# EAGLE design USBIOV2 (EAGLE 6.4)
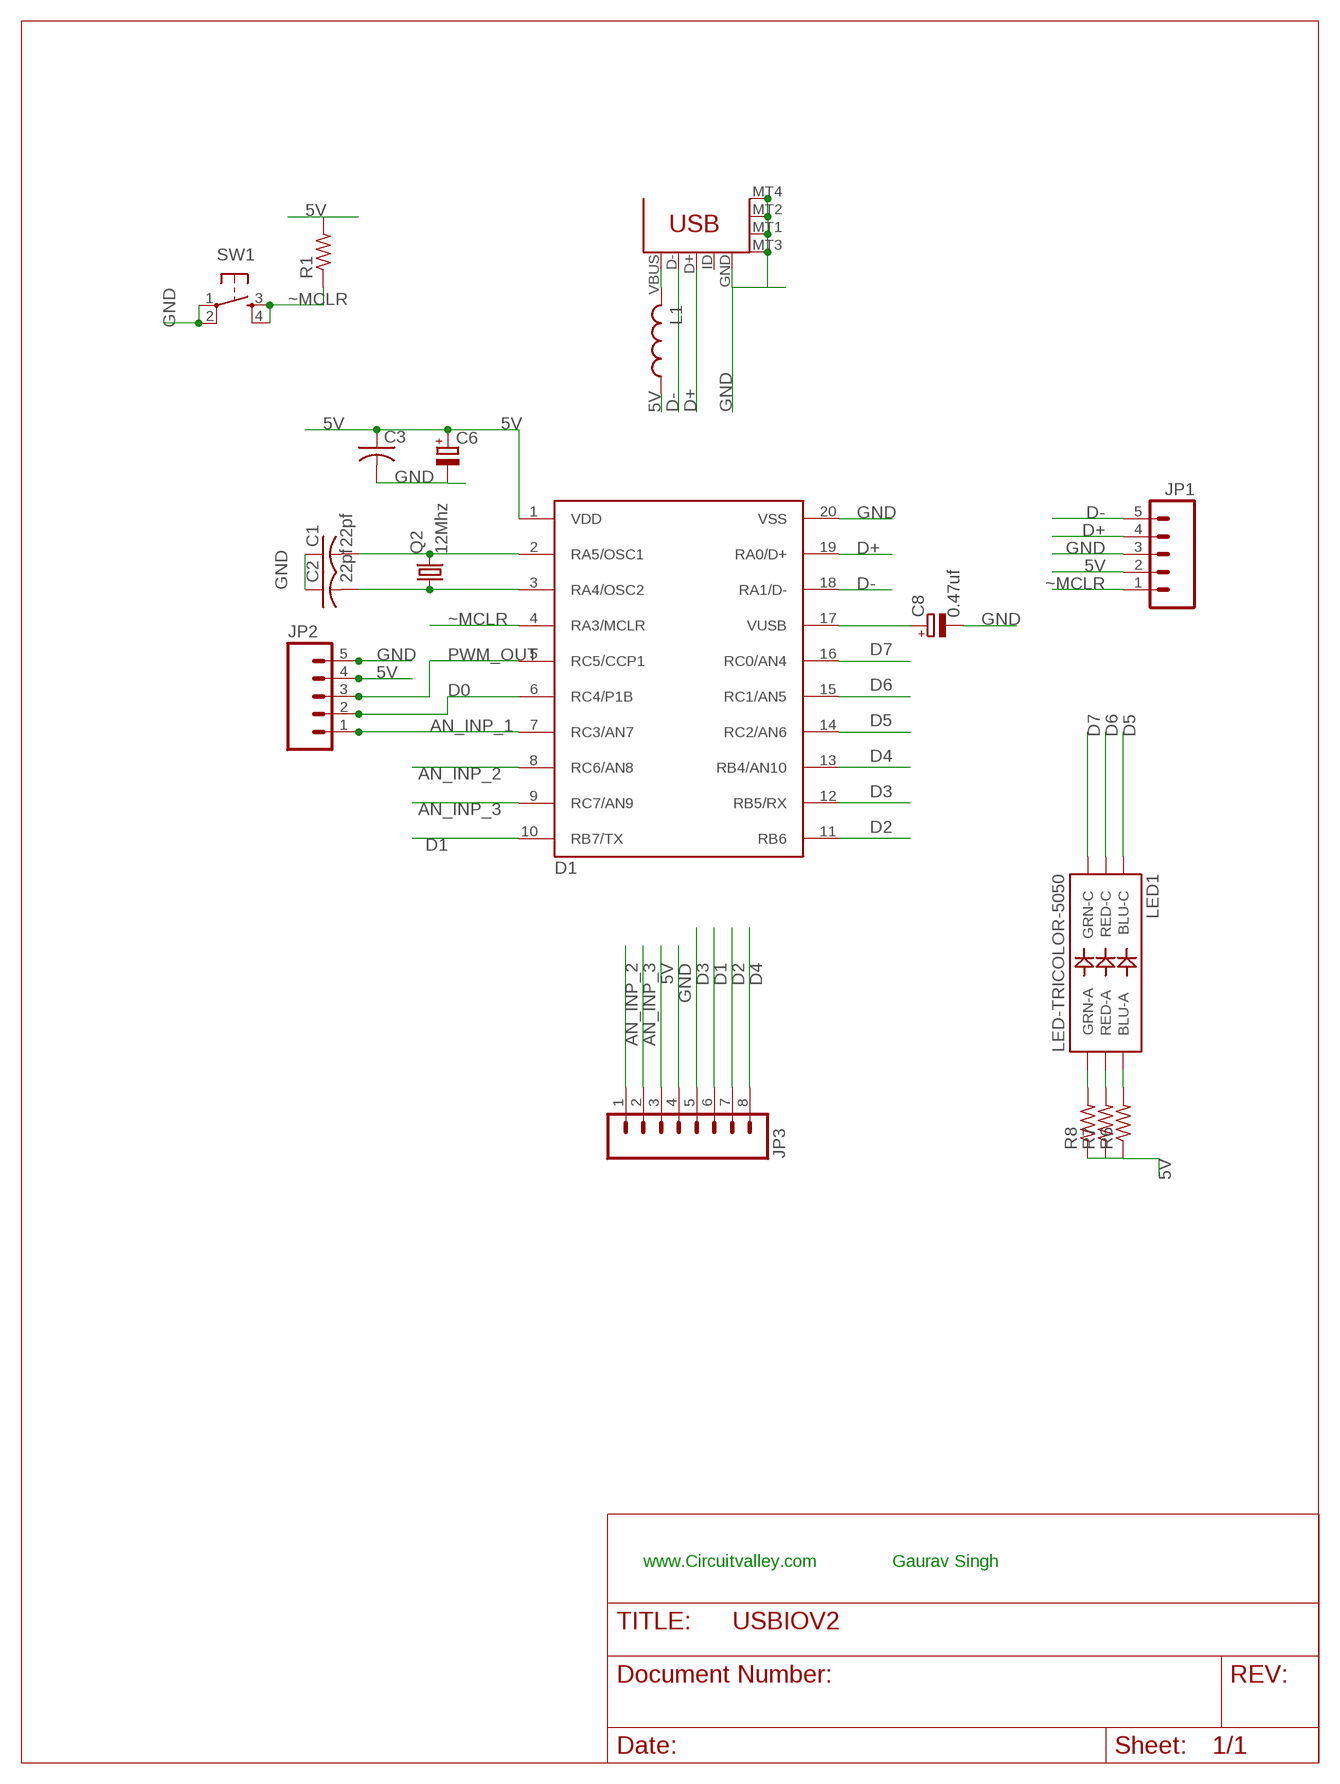
[diagram p0: schematic, sheet 1]

## Parts
C1  22pf  C-USC0805  [C0805]
C2  22pf  C-USC0805  [C0805]
C3  C-USC0805  [C0805]
C6  CAP_POLSMC_B  [SMC_B]
C8  0.47uf  CAP_POLSMC_B  [SMC_B]
D1  PIC18F14K50D  [SSOP20]
JP1  M05PTH  [1X05]
JP2  M05PTH  [1X05]
JP3  M081X08  [1X08]
L1  L-USL3225M  [L3225M]
LED1  LED-TRICOLOR-5050  [LED-TRICOLOR-5050]
Q2  12Mhz  CRYSTALHC49UP  [HC49UP]
R1  R-US_M0805  [M0805]
R6  R-US_M0805  [M0805]
R7  R-US_M0805  [M0805]
R8  R-US_M0805  [M0805]
SW1  SW-SMD-SMALL  [TACT_SWITCH_SMALL]
U$1  USB-MICROB-HW-MC-5F  [USB-MICROB-HW-MC-5F-01]

## Nets
5V: C3.1 C6.+ D1.1(VDD) JP1.2 JP2.4 JP3.3 L1.1 R1.2 R6.1 R7.1 R8.1
AN_INP_1: D1.7(RC3/AN7) JP2.1
AN_INP_2: D1.8(RC6/AN8) JP3.1
AN_INP_3: D1.9(RC7/AN9) JP3.2
D0: D1.6(RC4/P1B) JP2.2
D1: D1.10(RB7/TX) JP3.6
D2: D1.11(RB6) JP3.7
D3: D1.12(RB5/RX) JP3.5
D4: D1.13(RB4/AN10) JP3.8
D5: D1.14(RC2/AN6) LED1.1(BLU-C)
D6: D1.15(RC1/AN5) LED1.2(RED-C)
D7: D1.16(RC0/AN4) LED1.3(GRN-C)
D+: D1.19(RA0/D+) JP1.4 U$1.D+
D-: D1.18(RA1/D-) JP1.5 U$1.D-
GND: C1.1 C2.1 C3.2 C6.- C8.- D1.20(VSS) JP1.3 JP2.5 JP3.4 SW1.1 SW1.2 U$1.GND U$1.MT1(MTN3) U$1.MT2(MTN4) U$1.MT3(MTN1) U$1.MT4(MTN2)
N$1: C2.2 D1.3(RA4/OSC2) Q2.1
N$2: C1.2 D1.2(RA5/OSC1) Q2.2
N$13: LED1.6(BLU-A) R6.2
N$18: LED1.5(RED-A) R7.2
N$19: LED1.4(GRN-A) R8.2
N$55: C8.+ D1.17(VUSB)
PWM_OUT: D1.5(RC5/CCP1) JP2.3
VBUS5V: L1.2 U$1.VBUS
~MCLR: D1.4(RA3/MCLR) JP1.1 R1.1 SW1.3 SW1.4
Unconnected: U$1.ID

## Notes on the sheet
- www.Circuitvalley.com | Gaurav Singh

## Library data of the parts
C1-C3 = rcl:C-US: CAPACITOR, American symbol
C6 C8 = dp_devices:CAP_POL
D1 = pic18f14k50:PIC18F14K50: 20-Pin USB Flash Microcontrollers PIC18F14K50
JP1 JP2 = SparkFun:M05: Header 5 Standard 5-pin 0.1" header. Use with straight break away headers (SKU : PRT-00116), right angle break away headers (PRT-00553), swiss pins (PRT-00743), machine pins (PRT-00117), and female headers (PRT-00115). Molex polarized connector foot print use with SKU : PRT-08230 with associated crimp pins and housings.
JP3 = SparkFun:M08: Header 8 Standard 8-pin 0.1" header. Use with straight break away headers (SKU : PRT-00116), right angle break away headers (PRT-00553), swiss pins (PRT-00743), machine pins (PRT-00117), and female headers (PRT-00115).
L1 = rcl:L-US: INDUCTOR, American symbol
LED1 = SparkFun:LED-TRICOLOR-5050
Q2 = crystal:CRYSTAL: CRYSTAL; OC_FARNELL: unknown; OC_NEWARK: unknown
R1 R6-R8 = rcl:R-US_: RESISTOR, American symbol
SW1 = dp_devices:SW-SMD-SMALL
U$1 = SparkFun:USB-MICROB-HW-MC-5F

## Board
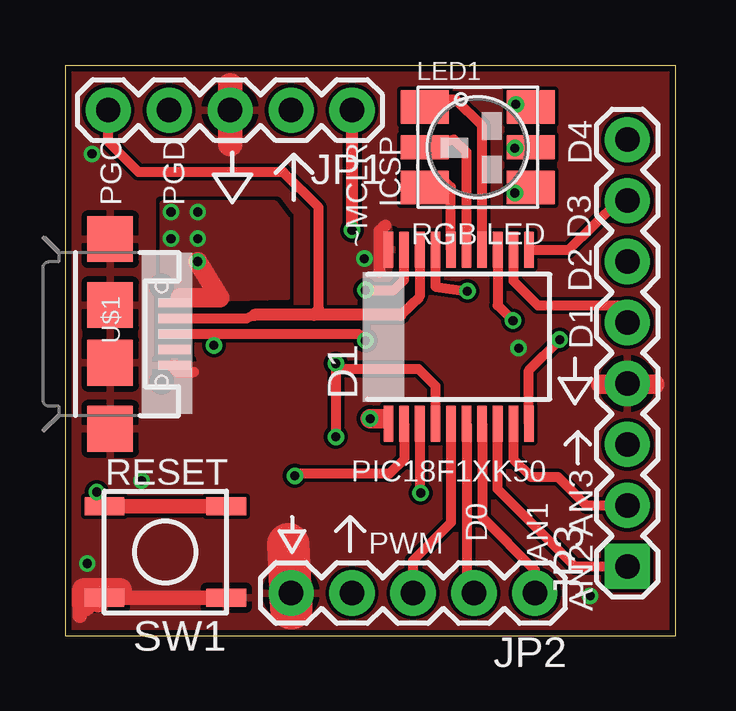
[diagram p1: board, top side]
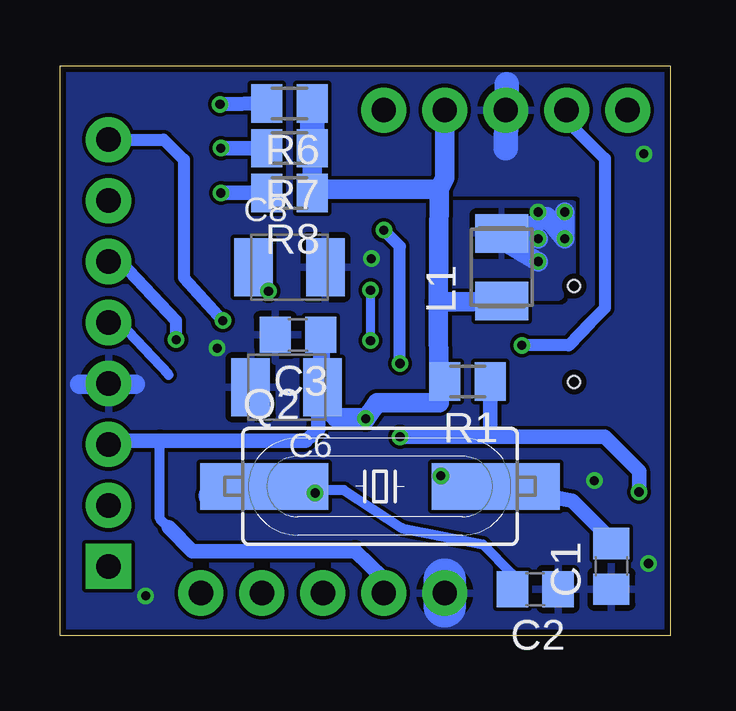
[diagram p2: board, bottom side, seen from below]

Size 25.44 x 23.75 mm. Coordinates in mm from the lower left corner, seen from the top.
Outline: 0,0 25.44,0 25.44,23.75 0,23.75 0,0
Copper layers (1*16): Top 0.035mm / dielectric 1.5mm / Bottom 0.035mm
Design rules "Fusion_eagle_rule_v1.1": minimum track width 6mil, minimum drill 12mil, track to track 6mil, track to pad 6mil, pad to pad 6mil, via to via 6mil, smd to smd 0mil, copper to edge 10mil, drill to drill 10mil, minimum pad ring 10mil, minimum via ring 6mil, stop-mask expansion 2mil, vias tented up to drill 100mil, thermal gap 10mil

### Footprints (pad centres in the part's own frame; a part is rotated, then mirrored left to right if it is on the bottom)
C0805 = smd 1.3 x 1.5: 1 -0.95,0; 2 0.95,0
SMC_B = smd 1.6 x 2.4: + -1.5,0; - 1.5,0
SSOP20 = smd 0.4 x 1.5: 1 -2.925,-3.625; 2 -2.275,-3.625; 3 -1.625,-3.625; 4 -0.975,-3.625; 5 -0.325,-3.625; 6 0.325,-3.625; 7 0.975,-3.625; 8 1.625,-3.625; 9 2.275,-3.625; 10 2.925,-3.625; 11 2.925,3.625; 12 2.275,3.625; 13 1.625,3.625; 14 0.975,3.625; 15 0.325,3.625; 16 -0.325,3.625; 17 -0.975,3.625; 18 -1.625,3.625; 19 -2.275,3.625; 20 -2.925,3.625
1X05 = drill 1.016 pad 1.88: 1 0,0; 2 2.54,0; 3 5.08,0; 4 7.62,0; 5 10.16,0
1X08 = drill 1.016 pad 1.88 square: 1 0,0 | drill 1.016 pad 1.88: 2 2.54,0; 3 5.08,0; 4 7.62,0; 5 10.16,0; 6 12.7,0; 7 15.24,0; 8 17.78,0
L3225M = smd 1.6 x 2.2: 1 -1.4,0; 2 1.4,0
LED-TRICOLOR-5050 = smd 2 x 1.4: 1 -2.2,1.681; 3 -2.2,-1.681; 4 2.2,-1.681; 6 2.2,1.681 | smd 2 x 1: 2 -2.2,0; 5 2.2,0
HC49UP = smd 5.334 x 1.93: 1 -4.826,0; 2 4.826,0
M0805 = smd 1.3 x 1.6: 1 -0.95,0; 2 0.95,0
TACT_SWITCH_SMALL = smd 1.651 x 0.762: 1 -2.54,1.905; 2 2.54,1.905; 3 -2.54,-1.905; 4 2.54,-1.905
USB-MICROB-HW-MC-5F-01 = smd 0.4 x 1.35: D+ 0,2.675; D- -0.65,2.675; ID 0.65,2.675 | smd 0.38 x 1.35: GND 1.3,2.675; VBUS -1.3,2.675 | smd 1.9 x 1.9: MT1 -3.95,0; MT2 3.95,0; MT3 1.2,0; MT4 -1.2,0 | hole 0.5: -2,2.15; 2,2.15

### Placement (x,y rotation side)
C1  2.46,2.9 90 bottom
C2  5.64,1.94 180 bottom
C3  15.52,12.54 180 bottom
C6  15.99,10.36 180 bottom
C8  15.88,15.36 0 bottom
D1  16.39,12.46 0 top
JP1  11.95,21.91 180 top
JP2  19.57,1.79 180 top
JP3  23.42,2.9 90 top
L1  7.02,15.36 90 bottom
LED1  17.18,20.36 0 top
Q2  12.1,6.23 0 bottom
R1  8.45,10.6 180 bottom
R6  15.88,22.19 180 bottom
R7  15.88,20.32 180 bottom
R8  15.88,18.45 180 bottom
SW1  4.17,3.49 180 top
U$1  1.87,12.58 270 top

### Tracks (layer width: path | path; a pad name or v marks a point on that pad's centre or on a via)
5V  (via drill 0.38)
  Top 0.406: 13.46,9.04 D1.1 13.25,9.05
  Top 0.813: v12.7,9.05 13.25,9.05
  Bottom 0.406: JP3.3 23.45,8.02 23.38,8.02 23.38,8.14 | 22.94,8.1 22.9,8.14 | R1.2 9.4,10.2 9.65,10.2 | 20.91,4.52 21.27,4.88 21.27,8.14
  Bottom 0.61: 23.54,8.14 23.38,8.14 22.9,8.14 21.27,8.14 15.2,8.14 14.68,8.61 14.68,9.09 14.31,9.46 | 20.91,4.52 19.92,3.53 13.14,3.53 11.99,2.42 11.99,1.55 JP2.4
  Bottom 0.7: C6.+ 14.53,10.88 14.53,12.14 C3.1
  Bottom 0.813: JP1.2 9.41,19.09 9.64,18.61 | 9.64,18.61 9.68,13.93 | 9.68,13.93 8.27,13.93 L1.1 | 9.68,13.93 9.65,10.2 9.64,9.72 12.22,9.72 v12.7,9.05 12.74,9.09 13.93,9.09 14.31,9.46 14.41,9.57 C6.+ | R7.1 R8.1 14.92,18.73 14.8,18.61 9.64,18.61
  Bottom 1.016: R6.1 R7.1
AN_INP_1
  Top 0.406: D1.7 17.37,4.94 19.57,2.74 JP2.1
AN_INP_2
  Top 0.406: JP3.1 21.23,2.9 18.02,6.11 D1.8
AN_INP_3
  Top 0.406: D1.9 18.67,7.37 19.41,6.63 20.52,6.63 21.71,5.44 JP3.2
D0
  Top 0.406: D1.6 16.72,1.82 JP2.2
D1  (via drill 0.38)
  Top 0.406: D1.10 19.32,11.06 v20.6,12.34
  Bottom 0.5: v20.6,12.34 20.6,13.14 22.9,15.6 JP3.6 24.05,15.6
D2
  Top 0.406: D1.11 20.97,16.09 23.06,18.14 JP3.7
D3
  Top 0.406: D1.12 18.67,14.79 19.68,13.77 23.14,13.77 JP3.5
  Bottom 0.406: 20.91,10.87 22.94,13.06 JP3.5
D4  (via drill 0.38)
  Top 0.406: D1.13 18.02,13.77 v18.65,13.14
  Bottom 0.406: v18.65,13.14 18.57,13.26
  Bottom 0.5: JP3.8 21.11,20.68 20.28,19.84 20.28,14.92 v18.65,13.14
D5
  Top 0.406: D1.14 17.37,21.25 16.27,22.34 15.04,22.34 LED1.1
D6
  Top 0.406: D1.15 16.72,20.15 16.19,20.68 LED1.2
D7
  Top 0.406: D1.16 16.07,18.7 15.8,18.97 15.05,18.97 LED1.3
D+  (via drill 0.38)
  Top 0.406: v12.5,14.41 13.69,14.41 14.12,14.83 D1.19 | 6.27,12.58 12.22,12.58 v12.5,12.3 | U$1.D+ 6.27,12.58 | 6.27,12.58 v6.19,12.11
  Bottom 0.381: v12.5,14.41 v12.5,12.3
  Bottom 0.5: JP1.4 4.33,21.47 2.74,19.88 2.74,13.65 3.33,13.06 4.25,12.11 v6.19,12.11
D-
  Top 0.406: D1.18 14.77,14.13 13.97,13.38 | U$1.D- 7.55,13.23 7.89,13.38 | 10.56,13.57 10.56,17.86 9.09,19.33 3.06,19.33 1.79,20.6 JP1.5
  Top 0.5: 13.97,13.38 10.36,13.38 | 10.36,13.38 7.89,13.38 | 10.56,13.57 10.36,13.38
GND  (via drill 0.38)
  Top 0.254: 13.1,15.64 D1.20
  Top 0.406: 5.36,10.99 4.64,10.99 4.41,11.22 U$1.GND
  Top 0.5: 13.1,15.16 13.1,15.64 13.1,16.87 13.34,17.11
  Top 0.61: SW1.1 SW1.2 1.35,1.27 0.79,1.91 | 0.59,1.31 0.59,0.83 | 0.79,1.31 0.59,1.31 | 0.59,1.31 0.59,1.71
  Top 0.813: 22.3,10.48 24.57,10.48
  Top 1.016: 6.87,20.48 6.87,22.94 | 2.26,1.91 0.79,1.91 0.79,1.31
  Top 1.778: 9.29,3.81 9.41,1.15
  Bottom 0.813: 22.3,10.48 24.61,10.48
  Bottom 1.016: 6.87,20.32 6.83,22.98
  Bottom 1.778: 9.41,2.34 9.41,1.23
  other vias: 12.46,15.72 18.89,11.99 3.17,6.47 0.91,3.02 1.11,20.08 21.87,1.67
  pour Top (rank 3): -0.91,24.01 26.43,24.33 26.27,-0.75 -0.52,-0.95
  pour Bottom (rank 3): -0.2,23.97 25.96,24.17 25.8,-0.44 -0.56,-1.27 -0.75,23.65
N$1  (via drill 0.38)
  Top 0.406: D1.3 14.77,5.99 v14.8,5.95
  Bottom 0.406: C2.2 6.59,2.58 7.82,3.81 11.19,4.49 13.61,6.07 14.68,6.07 v14.8,5.95 | v14.8,5.95 14.8,5.75 | v14.8,5.95 16.45,5.95 Q2.1
  Bottom 1.016: 19.15,5.83 Q2.1
N$2  (via drill 0.38)
  Top 0.406: D1.2 14.12,7.37 13.49,6.75 9.72,6.75 v9.56,6.67
  Bottom 0.406: Q2.2 8.95,5.64 9.37,6.06 9.37,6.43 9.41,6.67 v9.56,6.67
  Bottom 0.61: C1.2 2.46,4.01 4.09,5.64 Q2.2
N$13  (via drill 0.38 pad 0.61)
  Top 0.61: v18.77,22.15 19.33,22.11 LED1.6
  Bottom 0.61: R6.2 v18.77,22.15
N$18  (via drill 0.38 pad 0.61)
  Top 0.61: v18.73,20.32 LED1.5
  Bottom 0.61: R7.2 v18.73,20.32
N$19  (via drill 0.38 pad 0.61)
  Top 0.61: v18.73,18.45 19.97,18.38 LED1.4
  Bottom 0.61: R8.2 v18.73,18.45
N$55  (via drill 0.38)
  Top 0.406: D1.17 15.42,14.55 v16.75,14.37
  Bottom 0.61: v16.75,14.37 17.11,14.56 17.18,14.61 17.18,15.83 C8.+
PWM_OUT
  Top 0.406: D1.5 16.07,4.71 14.49,3.13 JP2.3
VBUS5V  (via drill 0.38)
  Top 0.406: 4.79,14.09 U$1.VBUS
  Top 0.813: v5.52,15.6 6.43,14.09 4.79,14.09
  Bottom 0.813: L1.2 7.14,16.63 v5.52,16.55 | 5.75,17.11 5.16,17.46 v4.41,16.55 v4.41,17.66 | 7.58,16.79 v5.52,15.6
  other vias: 5.52,17.66
  pour Top: 6.07,14.05 9.25,14.13 9.25,17.34 8.73,18.02 4.05,18.02 4.05,14.01
  pour Bottom: 4.05,18.02 9.56,18.02 9.6,14.09 4.64,14.09 4.05,14.72
~MCLR  (via drill 0.38, 0.38 pad 0.61)
  Top 0.406: v11.27,8.29 v11.27,11.35 11.39,11.11 14.72,11.11 15.42,10.42 D1.4 | SW1.4 1.71,5.28 1.19,5.4 v1.31,5.99
  Top 0.5: v11.95,16.91 JP1.1
  Top 0.61: SW1.4 SW1.3
  Bottom 0.5: v11.27,11.35 11.27,16.23 v11.95,16.91
  Bottom 0.61: v11.27,8.29 7.5,8.29 | 7.5,8.29 2.74,8.29 1.31,6.87 v1.31,5.99 | R1.1 7.5,8.29

### Text on the board
tSilk: D4 | PGC | PGD | ICSP | D3 | ~MCLR | RGB LED | D2 | D1 | RESET | PIC18F1XK50 | D0 | AN1 | PWM | AN3 | AN2
bSilk: C2B | RTS | PGC | PGD | C1R | C0G | ICSP | ~MCLR | CTS | C8 | R6 | TX | L1 | R7 | R8 | RX | C3 | R1 | C6 | R9 | DTR | www.circuitvalley.com | Designed by: / Gaurav Singh | DSR | C1 | C2